# Altium project BLDC_ESC.PrjPcb
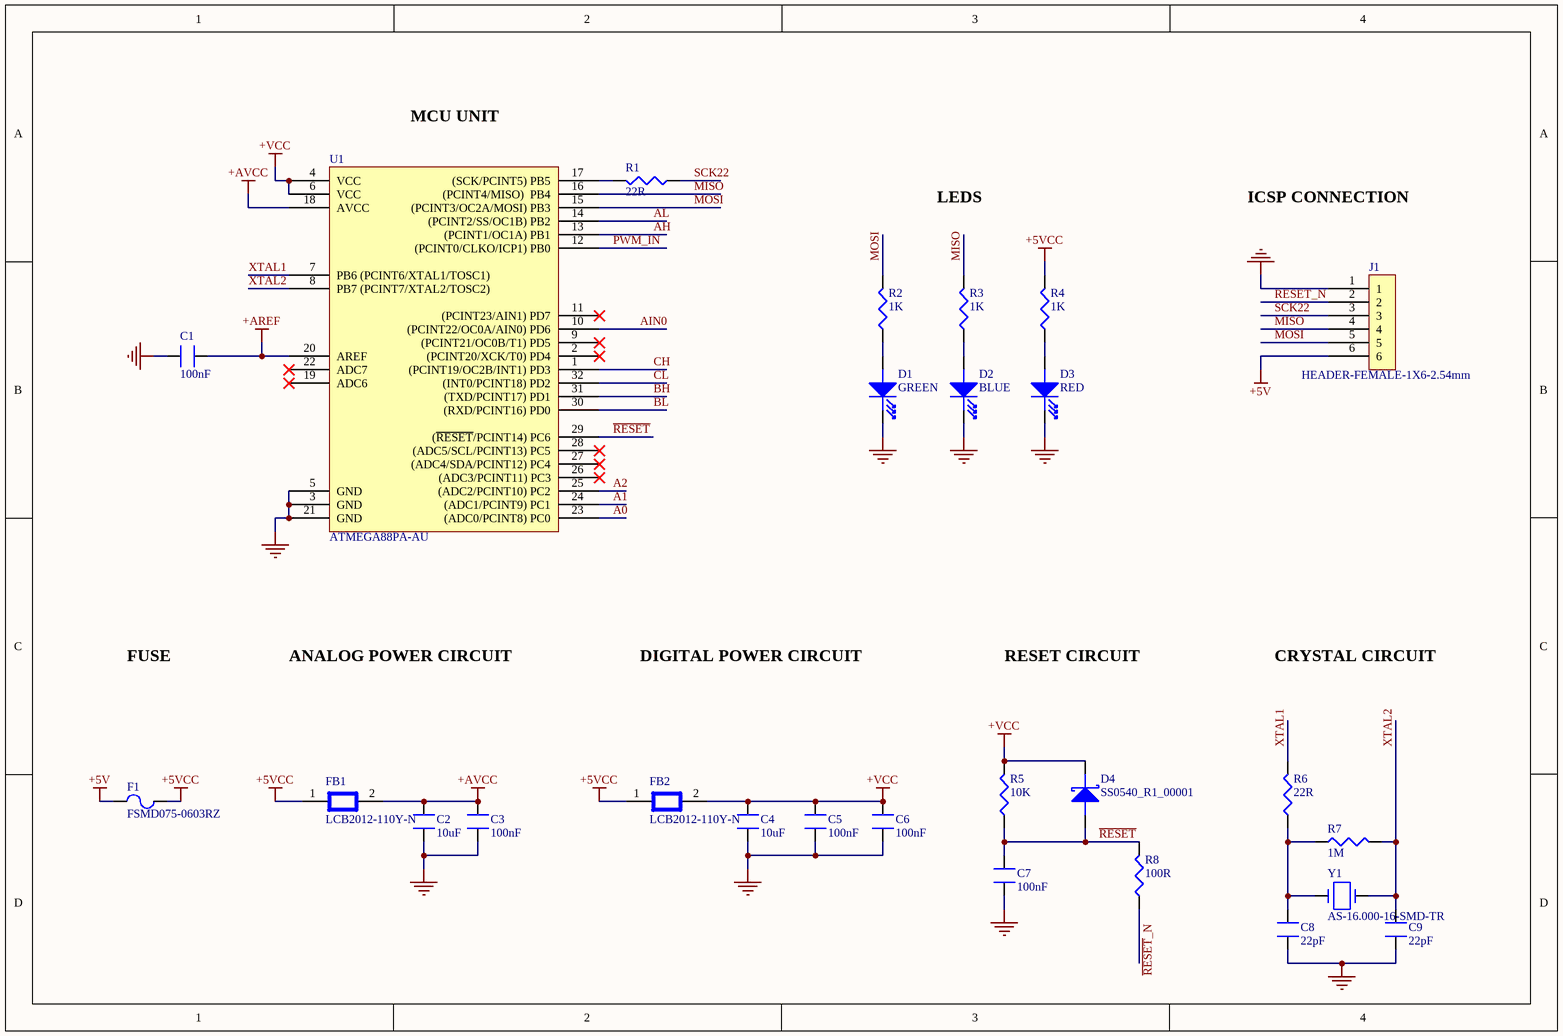
[diagram p0: ESC1.SchDoc]
Title: ESC
2 sheets, 69 parts. Net scope: global (net labels, ports and power ports of the same name join across sheets).
Board file: ESCV2.PcbDoc
Sheets:
  ESC1.SchDoc
  ESC2.SchDoc

## Sheet ESC1.SchDoc: ESC
size A4; DocumentNumber: 1; SheetNumber: 1; SheetTotal: 2

### Parts
C1  100nF  [Z0603]
C2  10uF  [Z0603]
C3  100nF  [Z0603]
C4  10uF  [Z0603]
C5  100nF  [Z0603]
C6  100nF  [Z0603]
C7  100nF  [Z0603]
C8  22pF  [Z0603]
C9  22pF  [Z0603]
D1  GREEN  [LED-0603]
D2  BLUE  [LED-0603]
D3  RED  [LED-0603]
D4  SS0540_R1_00001  [SOD-123]
F1  FSMD075-0603RZ  [F-0603]
FB1  LCB2012-110Y-N  [C0805]
FB2  LCB2012-110Y-N  [C0805]
J1  HEADER-FEMALE-1X6-2.54mm  [FEMALE-1X6-2.54mm]
R1  22R  [Z0603]
R2  1K  [Z0603]
R3  1K  [Z0603]
R4  1K  [Z0603]
R5  10K  [Z0603]
R6  22R  [Z0603]
R7  1M  [Z0603]
R8  100R  [Z0603]
U1  ATMEGA88PA-AU  [TQFP32(ATMEGA88)]
Y1  AS-16.000-16-SMD-TR  [AS-16.000-16-SMD-TR]

### Nets
+5V: F1.1 J1.6
+5VCC: F1.2 FB1.1 FB2.1 R4.2
+AREF: C1.1 U1.20(AREF)
+AVCC: C2.2 C3.2 FB1.2 U1.18(AVCC)
+VCC: C4.2 C5.2 C6.2 D4.1(Cathode) FB2.2 R5.2 U1.4(VCC) U1.6(VCC)
GND: C1.2 C2.1 C3.1 C4.1 C5.1 C6.1 C7.1 C8.2 C9.2 D1.1(Cathode) D2.1(Cathode) D3.1(Cathode) J1.1 U1.3(GND) U1.5(GND) U1.21(GND)
A0: U1.23((ADC0/PCINT8)_PC0)
A1: U1.24((ADC1/PCINT9)_PC1)
A2: U1.25((ADC2/PCINT10)_PC2)
AH: U1.13((PCINT1/OC1A)_PB1)
AIN0: U1.10((PCINT22/OC0A/AIN0)_PD6)
AL: U1.14((PCINT2/SS/OC1B)_PB2)
BH: U1.31((TXD/PCINT17)_PD1)
BL: U1.30((RXD/PCINT16)_PD0)
CH: U1.1((PCINT19/OC2B/INT1)_PD3)
CL: U1.32((INT0/PCINT18)_PD2)
MISO: J1.4 R3.2 U1.16((PCINT4/MISO)__PB4)
MOSI: J1.5 R2.2 U1.15((PCINT3/OC2A/MOSI)_PB3)
PWM_IN: U1.12((PCINT0/CLKO/ICP1)_PB0)
~{RESET}: C7.2 D4.2(Anode) R5.1 R8.2 U1.29((~{RESET}/PCINT14)_PC6)
~{RESET}_N: J1.2 R8.1
SCK22: J1.3 R1.1
XTAL1: R6.2 U1.7(PB6_(PCINT6/XTAL1/TOSC1))
XTAL2: C9.1 R7.2 U1.8(PB7_(PCINT7/XTAL2/TOSC2)) Y1.2
NetC8_1: C8.1 R6.1 R7.1 Y1.1
NetD1_2: D1.2(Anode) R2.1
NetD2_2: D2.2(Anode) R3.1
NetD3_2: D3.2(Anode) R4.1
NetR1_2: R1.2 U1.17((SCK/PCINT5)_PB5)

Not connected (* = marked no-connect by the designer): U1 2((PCINT20/XCK/T0)_PD4)* 9((PCINT21/OC0B/T1)_PD5)* 11((PCINT23/AIN1)_PD7)* 19(ADC6)* 22(ADC7)* 26((ADC3/PCINT11)_PC3)* 27((ADC4/SDA/PCINT12)_PC4)* 28((ADC5/SCL/PCINT13)_PC5)*

### Notes on the sheet
- MCU UNIT
- LEDS
- ICSP CONNECTION
- FUSE
- ANALOG POWER CIRCUIT
- DIGITAL POWER CIRCUIT
- RESET CIRCUIT
- CRYSTAL CIRCUIT

### Library data of the parts
C1 C3 C5-C7 = CL10B104KB8NNNC: Multi Layer Ceramic Capacitor (MLCC) / Cap Ceramic 0.1uF 50V X7R 10% Pad SMD 0603 125¡ãC T/R; Manufacturer: Samsung; OZDISAN_PRICE: 0.05 TRY; Supplier 1: RSComponents; Manufacturer Part Number: CL10B104KB8NNNC; RoHS: Yes; Category: Ceramic Capacitors; Stock 1: 17024000; Pricing 1: 4000=0,00800, 8000=0,00800, 16000=0,00800, 24000=0,00700, 40000=0,00600, 4000=0,00600, 8000=0,00600, 16000=0,00600, 24000=0,00500, 40000=0,00400 (USD); Mount: Surface Mount; Case/Package: 0603; Case Code (Metric): 1608; Case Code (Imperial): 0603; Material: Ceramic; Contact Plating: Tin; Min Operating Temperature: -55°C; Max Operating Temperature: 125°C; Capacitance: 100nF; Dielectric: X7R; Tolerance: 10%; Voltage Rating: 50V; Package Quantity: 1; Packaging: Tape and Reel; Voltage: 50V; Voltage Rating (DC): 50V; Series: CL; Construction: Flat; Length: 1.6mm; Width: 0.031inch; Height: 0.8mm; Depth: 0.8mm; Thickness: 0.035inch; Radiation Hardening: No; Lead Free: Lead Free; RoHS Compliant: Yes; Supplier Part Number 1: 7665443; ComponentLink4Description: OZDISAN_LINK; ComponentLink4URL: https://ozdisan.com/pasif-komponentler/kondansatorler/smt-smd-ve-mlcc-kondansatorler/CL10B104KB8NNNC
C2 C4 = CL10A106KP8NNNC: Cap Ceramic 10uF 10V X5R 10% Pad SMD 0603 85C T/R; Manufacturer: Samsung; OZDISAN_PRICE: 0.60 TRY; Supplier 1: Future Electronics; Manufacturer Part Number: CL10A106KP8NNNC; RoHS: Yes; Category: Ceramic Capacitors; Stock 1: 202000; Pricing 1: 4000=0,03170, 8000=0,02840, 12000=0,02830, 20000=0,02810, 40000=0,02790 (USD); Mount: Surface Mount; Case/Package: 0603; Case Code (Metric): 1608; Case Code (Imperial): 0603; Material: Ceramic; Contact Plating: Tin; Min Operating Temperature: -55°C; Max Operating Temperature: 85°C; Capacitance: 10uF; Tolerance: 10%; Dielectric: X5R; Package Quantity: 1; Packaging: Tape and Reel; Voltage Rating: 10V; Voltage Rating (DC): 10V; Series: CL; Construction: Flat; Length: 1.6mm; Width: 0.031inch; Height: 0.8mm; Thickness: 0.035inch; Depth: 0.8mm; Radiation Hardening: No; Lead Free: Lead Free; RoHS Compliant: Yes; Supplier Part Number 1: 5232459; ComponentLink4Description: OZDISAN_LINK; ComponentLink4URL: https://ozdisan.com/Product/Detail/350863/CL10A106KP8NNNC
C8 C9 = CL10C220JB8NNNC: Ceramic capacitor SMD-0603 22pF /50V NP0# J +-5%, Samsung, RoHS; Tolerance: 5%; Dielectric: C0G; Voltage: 50V; Temperature Coefficient: 300ppm/°C; OZDISAN_PRICE: 0.09 TRY; Supplier 1: RSComponents; Manufacturer: Samsung; Manufacturer Part Number: CL10C220JB8NNNC; RoHS: Yes; Category: Ceramic Capacitors; Stock 1: 1; Pricing 1: 4000=0,01100, 8000=0,01100, 16000=0,01000, 24000=0,00800, 40000=0,00700 (USD); Mount: Surface Mount; Case/Package: 0603; Case Code (Metric): 1608; Case Code (Imperial): 0603; Material: Ceramic; Contact Plating: Tin; Min Operating Temperature: -55°C; Max Operating Temperature: 125°C; Capacitance: 22pF; Voltage Rating (DC): 50V; Voltage Rating: 50V; Package Quantity: 1; Packaging: Tape and Reel; Series: CL; Length: 0.063inch; Width: 0.031inch; Height: 0.8mm; Depth: 0.8mm; Thickness: 0.035inch; Radiation Hardening: No; Lead Free: Lead Free; RoHS Compliant: Yes; Supplier Part Number 1: 7665033; ComponentLink5Description: OZDISAN_LINK; ComponentLink5URL: https://ozdisan.com/pasif-komponentler/kondansatorler/smt-smd-ve-mlcc-kondansatorler/CL10C220JB8NNNC
D1 = HL-PST-1608U51GC: OZDISAN_PRICE: 0.22 TRY; Case-Package: 0603; ComponentLink1Description: OZDISAN_LINK; ComponentLink1URL: https://ozdisan.com/Product/Detail/471660/HL-PST-1608U51GC
D2 = 27-21/B7C-ZR1S1N/3C: OZDISAN_PRICE: 1,46 TRY; ComponentLink1Description: OZDISAN_LINK; ComponentLink1URL: https://ozdisan.com/led-ve-aydinlatma-cozumleri/led-komponentler/sinyal-ledler-renkli/27-21B7C-ZR1S1N3C; Case-Package: 0603
D3 = LTST-C190KRKT: 0603 red led alingap 631nm-639nm water clear 18-180mcd 130d; Manufacturer: Vishay Lite-On; Lens Color: Colorless; Luminous Intensity: 54mcd; Forward Current: 30mA; Viewing Angle: 130°; Forward Voltage: 2.4V; Lens Style: Diffused,Colorless,Clear,Rectangular; Power Rating: 75mW; Dominant Wavelength: 631nm; Test Current: 20mA; Number of Elements: 1; Wavelength: 639nm; Reverse Voltage: 5V; OZDISAN_PRICE: 0.38 TRY; Supplier 1: Digi-Key; Manufacturer Part Number: LTST-C190KRKT; RoHS: Yes; Category: LEDs; Stock 1: 874288; Pricing 1: 1=0,24000, 10=0,13200, 100=0,06110, 500=0,05640, 1000=0,04418, 2000=0,04324 (USD); Mount: Surface Mount; Case/Package: 0603; Number of Pins: 2; Color: Red; Case Code (Metric): 1608; Case Code (Imperial): 0603; Min Operating Temperature: -55°C; Max Operating Temperature: 85°C; Packaging: Tape and Reel; Package Quantity: 1; Illumination Color: Red; Lens Transparency: Clear; Power Dissipation: 75mW; Number of LEDs: 1; Length: 1.6mm; Width: 0.8mm; Height: 0.8mm; Depth: 0.8mm; Radiation Hardening: No; Lead Free: Lead Free; RoHS Compliant: Yes; Supplier Part Number 1: 160-1436-1-ND; ComponentLink10Description: OZDISAN_LINK; ComponentLink10URL: https://ozdisan.com/led-ve-aydinlatma-cozumleri/led-komponentler/sinyal-ledler-renkli/LTST-C190KRKT
D4 = SS0540_R1_00001: Diode Schottky 40V 0.5A 2-Pin SOD-123 T/R; Manufacturer: Pan Jit; Peak Non-Repetitive Surge Current: 5.5A; Element Configuration: Single; OZDISAN_PRICE: 0.55 TRY; Supplier 1: Digi-Key; Manufacturer Part Number: SS0540_R1_00001; RoHS: Yes; Category: Rectifier Diodes; Stock 1: 6025; Pricing 1: 1=0,29000, 10=0,23400, 100=0,12410, 500=0,08168, 1000=0,05554 (USD); Mount: Surface Mount; Min Operating Temperature: -55°C; Max Operating Temperature: 125°C; Max Repetitive Reverse Voltage (Vrrm): 40V; Radiation Hardening: No; RoHS Compliant: Yes; Supplier Part Number 1: 3757-SS0540_R1_00001CT-ND; ComponentLink3Description: OZDISAN_LINK; ComponentLink3URL: https://ozdisan.com/guc-yari-iletkenleri/diyotlar-modul-diyotlar-ve-dogrultucular/schottky-diyotlar/SS0540R100001
F1 = FSMD075-0603RZ: OZDISAN_PRICE: 3.16 TRY; Current Rating: 0.75; Max Voltage: 6V; Case-Package: 0603; ComponentLink1Description: OZDISAN_LINK; ComponentLink1URL: https://ozdisan.com/guc-yari-iletkenleri/devre-koruyucu-komponentler/ptc-sigortalar/FSMD075-0603RZ
FB1 FB2 = LCB2012-110Y-N: OZDISAN_PRICE: 0,22 TRY; ComponentLink1Description: OZDISAN_LINK; ComponentLink1URL: https://ozdisan.com/pasif-komponentler/induktorler/bead-feritler/LCB2012-110Y-N; Case-Package: 0603
J1 = PPPC061LFBN-RC: CONN HDR 6POS 0.1 GOLD PCB; Manufacturer: Sullins; Connector Type: Header,Socket; Number of Positions: 6; Pitch: 0.1inch; Supplier 1: Digi-Key; Manufacturer Part Number: PPPC061LFBN-RC; RoHS: Yes; Category: Connectors; Stock 1: 33601; Pricing 1: 1=0,53000, 10=0,46500, 80=0,38300, 440=0,33300, 1000=0,27472, 5000=0,24142, 10000=0,24050 (USD); Mount: Through Hole; Color: Black; Contact Plating: Gold; Housing Material: Plastic; Contact Material: Bronze; Package Quantity: 1000; Number of Rows: 1; Packaging: Bulk; Termination: Solder; Length: 15.7mm; Width: 2.5mm; Height: 8.5mm; Lead Free: Lead Free; ComponentLink1URL: https://media.digikey.com/pdf/Data%20Sheets/Sullins%20PDFs/Female_Headers.100_DS.pdf?src-supplier=Digi-Key; ComponentLink1Description: https://media.digikey.com/pdf/Data%20Sheets/Sullins%20PDFs/Female_Headers.100_DS.pdf?src-supplier=Digi-Key; Supplier Part Number 1: S7039-ND
R1 R6 = MC0603SAF220JT5E: MULTICOMP         MC0603SAF220JT5E            RESISTOR, THICK FILM, 22OHM, 100mW, 1%; Voltage Rating: 75V; Temperature Coefficient: 100ppm/°C; OZDISAN_PRICE: 0.02 TRY; Supplier 1: Newark; Manufacturer: Multicomp; Manufacturer Part Number: MC0603SAF220JT5E; RoHS: Yes; Category: Resistors; Case/Package: 0603; Number of Pins: 2; Case Code (Metric): 1608; Case Code (Imperial): 0603; Packaging: Cut Tape; Resistance: 22R; Resistor Type: Thick Film; Power Rating: 100mW; Tolerance: 1%; Voltage Rating (DC): 75V; Resistance Tolerance: 1%; RoHS Compliant: Yes; REACH SVHC: Unknown; Supplier Part Number 1: 79M5934; ComponentLink2Description: OZDISAN_LINK; ComponentLink2URL: https://ozdisan.com/pasif-komponentler/direncler/smt-smd-ve-cip-direncler/0603SAF220JT5E
R2-R4 = MC0603SAF1001T5E: MULTICOMP - MC0603SAF1001T5E - THICK FILM RESISTOR, 1KOHM, 100mW, 1%; Resistance: 1kR; Voltage Rating: 75V; Temperature Coefficient: 100ppm/°C; OZDISAN_PRICE: 0.02 TRY; Supplier 1: Farnell; Manufacturer: Multicomp; Manufacturer Part Number: MC0603SAF1001T5E; RoHS: Yes; Category: Resistors; Stock 1: 340; Pricing 1: 1=0,00890, 10=0,00810, 100=0,00730, 1000=0,00390 (GBP); Case/Package: 0603; Case Code (Metric): 1608; Case Code (Imperial): 0603; Tolerance: 1%; Power Rating: 100mW; Resistor Type: Thick Film; Packaging: Cut Tape; Voltage Rating (DC): 75V; Resistance Tolerance: 1%; RoHS Compliant: Yes; REACH SVHC: Unknown; Supplier Part Number 1: 1632391; ComponentLink2Description: OZDISAN_LINK; ComponentLink2URL: https://ozdisan.com/pasif-komponentler/direncler/smt-smd-ve-cip-direncler/0603SAF1001T5E
R5 = CQ03SAF1002T5E: OZDISAN_PRICE: 0.03 TRY; ComponentLink1Description: OZDISAN_LINK; ComponentLink1URL: https://ozdisan.com/pasif-komponentler/direncler/smt-smd-ve-cip-direncler/CQ03SAF1002T5E; Case-Package: 0603
R7 = MC0603SAF1004T5E: Res General Purpose Thick Film 0603 1M Ohm 1% 1/10W ±100ppm/°C Molded T/R; Manufacturer: Multicomp; Resistance: 1MR; Power Rating: 100mW; Voltage Rating: 75V; OZDISAN_PRICE: 0.02 TRY; Supplier 1: Farnell; Manufacturer Part Number: MC0603SAF1004T5E; RoHS: Yes; Category: Uncategorized; Stock 1: 15998; Pricing 1: 1=0,00910, 10=0,00830, 100=0,00740, 1000=0,00400 (GBP); Case/Package: 0603; Case Code (Metric): 1608; Case Code (Imperial): 0603; Tolerance: 1%; Resistor Type: Thick Film; Packaging: Cut Tape; Temperature Coefficient: 100ppm/°C; Voltage Rating (DC): 75V; Resistance Tolerance: 1%; REACH SVHC: Unknown; RoHS Compliant: Yes; ComponentLink1URL: https://datasheet.ciiva.com/7919/ta-677-7919113.pdf?src-supplier=Element14; ComponentLink1Description: https://datasheet.ciiva.com/7919/ta-677-7919113.pdf?src-supplier=Element14; Supplier Part Number 1: 1631320; ComponentLink2Description: ÖZDISAN_LINK; ComponentLink2URL: https://ozdisan.com/pasif-komponentler/direncler/smt-smd-ve-cip-direncler/0603SAF1004T5E
R8 = 0603SAJ0101T5E: OZDISAN_PRICE: 0.02 TRY; ComponentLink1Description: OZDISAN_LINK; ComponentLink1URL: https://ozdisan.com/pasif-komponentler/direncler/smt-smd-ve-cip-direncler/0603SAJ0101T5E; Case-Package: 0603
U1 = ATMEGA88PA-AU: MCU 8-bit ATmega AVR RISC 8KB Flash 2.5V/3.3V/5V 32-Pin TQFP; Manufacturer: Microchip / Atmel; Interface: SPI,UART,I2C,USART,2-Wire; Frequency: 20MHz; Number of I/Os: 23; Oscillator Type: Internal; Peripherals: Brown-out Detect/Reset,POR,PWM,WDT; RAM Size: 1KB; Max Supply Voltage: 5.5V; Min Supply Voltage: 1.8V; Number of Timers/Counters: 3; Data Bus Width: 8b; Watchdog Timer: Yes; Number of PWM Channels: 6; Number of ADC Channels: 8; Number of SPI Channels: 1; Voltage: 5V; OZDISAN_PRICE: 33,63 TRY; Supplier 1: Arrow Electronics; Manufacturer Part Number: ATMEGA88PA-AU; RoHS: Yes; Category: Microcontrollers; Mount: Surface Mount; Case/Package: A; Number of Pins: 32; Contact Plating: Tin,Matte; Min Operating Temperature: -40°C; Max Operating Temperature: 85°C; Packaging: Tray; Core Architecture: AVR; Package Quantity: 250; Memory Type: FLASH; Memory Size: 8KB; Number of Programmable I/O: 23; Max Frequency: 20MHz; Density: 8KB; Number of I2C Channels: 1; Termination: SMD/SMT; Series: AVR® ATmega; Length: 7mm; Width: 7mm; Height: 1.05mm; Radiation Hardening: No; REACH SVHC: No SVHC; Lead Free: Lead Free; Supplier Part Number 1: ATMEGA88PA-AU; ComponentLink4Description: OZDISAN_LINK; ComponentLink4URL: https://ozdisan.com/entegre-devreler-ics/embedded-entegreler/mikroislemciler/ATMEGA88PA-AU
Y1 = AS-16.000-16-SMD-TR: AS-SMD Series 16 MHz ±30 ppm 16pF -20°C TO +70°C SMT Microprocessor Crystal; Manufacturer: Raltron Electronics; Frequency Tolerance: 30ppm; Frequency: 16MHz; Capacitance: 1.6E-11F; OZDISAN_PRICE: 1.95 TRY; Supplier 1: Future Electronics; Manufacturer Part Number: AS-16.000-16-SMD-TR; RoHS: Yes; Pricing 1: 1000=0,12700 (USD); Min Operating Temperature: -20°C; Max Operating Temperature: 70°C; Load Capacitance: 16pF; Lead Free: Lead Free; Supplier Part Number 1: 5574900; ComponentLink2Description: OZDISAN_LINK; ComponentLink2URL: https://ozdisan.com/Product/Detail/40446/AS-16-000-16-SMD-TR

## Sheet ESC2.SchDoc: ESC
size A4; DrawnBy: BRAIN.DLL; DocumentNumber: 2; Revision: REV 1.0; SheetNumber: 2; SheetTotal: 2
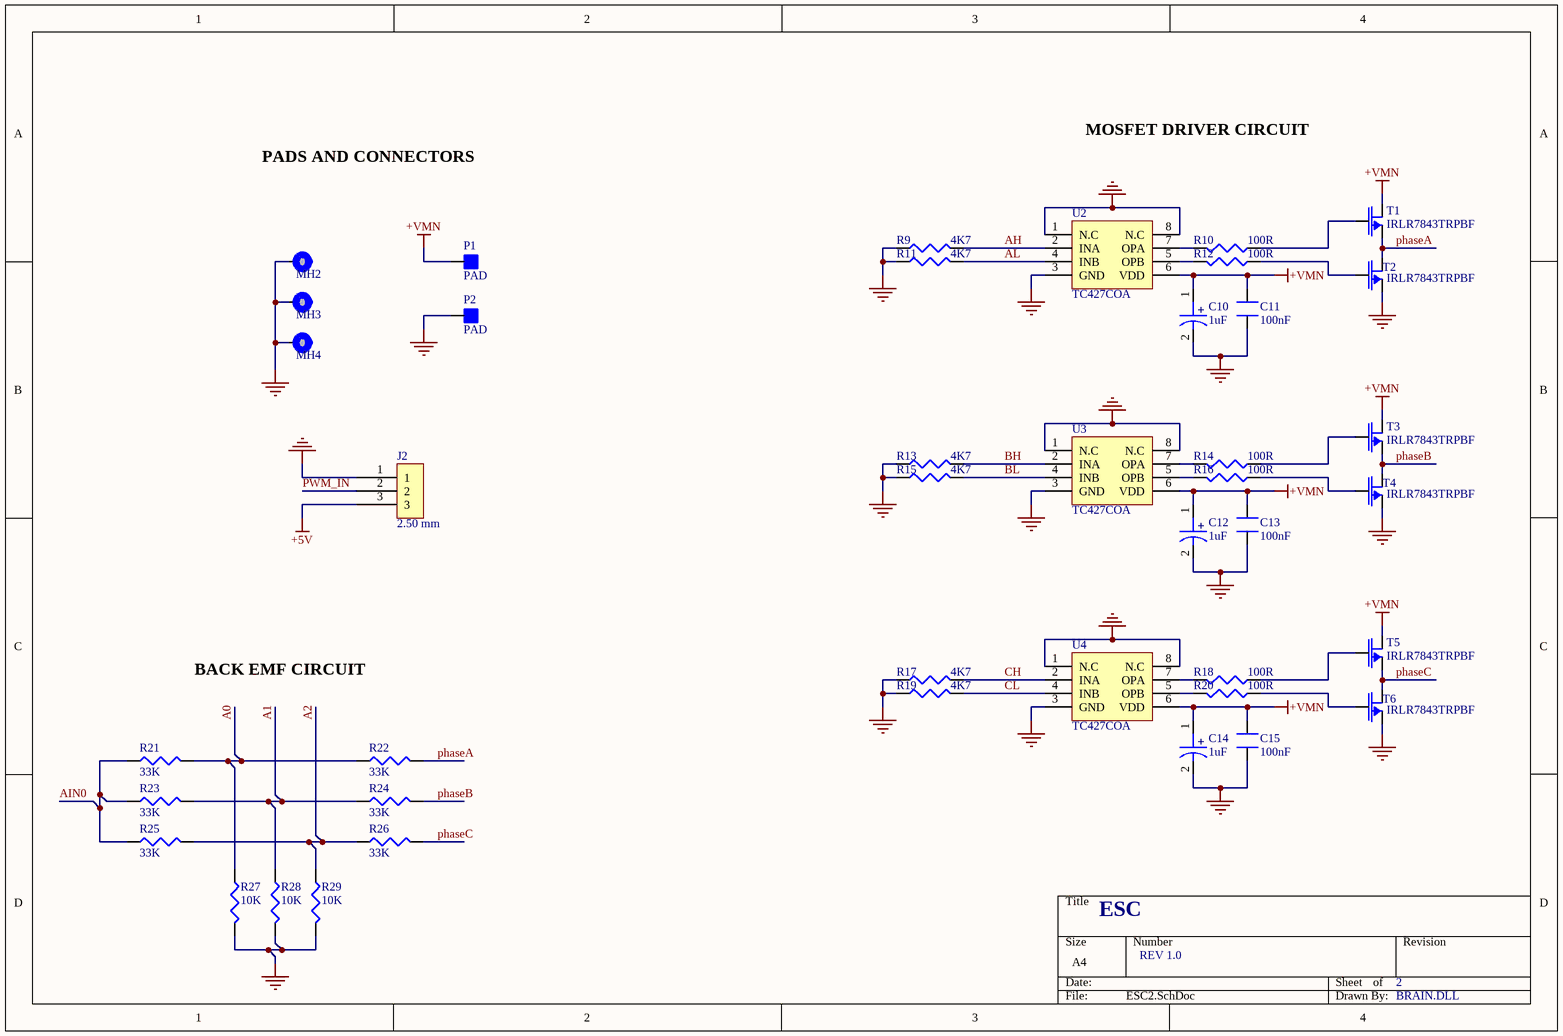
[diagram p1: ESC2.SchDoc]

### Parts
C10  1uF  [1206 TANTAL CAP]
C11  100nF  [Z0603]
C12  1uF  [1206 TANTAL CAP]
C13  100nF  [Z0603]
C14  1uF  [1206 TANTAL CAP]
C15  100nF  [Z0603]
J2  2.50 mm  [L-KLS1-XL4-2.50-03-R]
MH2  MH_7.4MMC_3.2MMD  [MH_7.4MMC_3.2MMD_NON_COPPER_NPLT]  (value not drawn)  (no BOM)
MH3  MH_7.4MMC_3.2MMD  [MH_7.4MMC_3.2MMD_NON_COPPER_NPLT]  (value not drawn)  (no BOM)
MH4  MH_7.4MMC_3.2MMD  [MH_7.4MMC_3.2MMD_NON_COPPER_NPLT]  (value not drawn)  (no BOM)
P1  PAD  [SQARE_PAD]  (no BOM)
P2  PAD  [SQARE_PAD]  (no BOM)
R9  4K7  [Z0603]
R10  100R  [Z0603]
R11  4K7  [Z0603]
R12  100R  [Z0603]
R13  4K7  [Z0603]
R14  100R  [Z0603]
R15  4K7  [Z0603]
R16  100R  [Z0603]
R17  4K7  [Z0603]
R18  100R  [Z0603]
R19  4K7  [Z0603]
R20  100R  [Z0603]
R21  33K  [Z0603]
R22  33K  [Z0603]
R23  33K  [Z0603]
R24  33K  [Z0603]
R25  33K  [Z0603]
R26  33K  [Z0603]
R27  10K  [Z0603]
R28  10K  [Z0603]
R29  10K  [Z0603]
T1  IRLR7843TRPBF  [TO-252-3]
T2  IRLR7843TRPBF  [TO-252-3]
T3  IRLR7843TRPBF  [TO-252-3]
T4  IRLR7843TRPBF  [TO-252-3]
T5  IRLR7843TRPBF  [TO-252-3]
T6  IRLR7843TRPBF  [TO-252-3]
U2  TC427COA  [SOIC-8]
U3  TC427COA  [SOIC-8]
U4  TC427COA  [SOIC-8]

### Nets
+5V: J2.3
+VMN: C10.1 C11.1 C12.1 C13.1 C14.1 C15.1 P1.1 T1.2(DRAIN) T3.2(DRAIN) T5.2(DRAIN) U2.6(VDD) U3.6(VDD) U4.6(VDD)
GND: C10.2 C11.2 C12.2 C13.2 C14.2 C15.2 J2.1 MH2.1 MH3.1 MH4.1 P2.1 R9.1 R11.1 R13.1 R15.1 R17.1 R19.1 R27.2 R28.2 R29.2 T2.3(SOURCE) T4.3(SOURCE) T6.3(SOURCE) U2.1(N.C) U2.3(GND) U2.8(N.C) U3.1(N.C) U3.3(GND) U3.8(N.C) U4.1(N.C) U4.3(GND) U4.8(N.C)
A0: R21.2 R22.1 R27.1
A1: R23.2 R24.1 R28.1
A2: R25.2 R26.1 R29.1
AH: R9.2 U2.2(INA)
AIN0: R21.1 R23.1 R25.1
AL: R11.2 U2.4(INB)
BH: R13.2 U3.2(INA)
BL: R15.2 U3.4(INB)
CH: R17.2 U4.2(INA)
CL: R19.2 U4.4(INB)
phaseA: R22.2 T1.3(SOURCE) T2.2(DRAIN)
phaseB: R24.2 T3.3(SOURCE) T4.2(DRAIN)
phaseC: R26.2 T5.3(SOURCE) T6.2(DRAIN)
PWM_IN: J2.2
NetR10_1: R10.1 T1.1(GATE)
NetR10_2: R10.2 U2.7(OPA)
NetR12_1: R12.1 T2.1(GATE)
NetR12_2: R12.2 U2.5(OPB)
NetR14_1: R14.1 T3.1(GATE)
NetR14_2: R14.2 U3.7(OPA)
NetR16_1: R16.1 T4.1(GATE)
NetR16_2: R16.2 U3.5(OPB)
NetR18_1: R18.1 T5.1(GATE)
NetR18_2: R18.2 U4.7(OPA)
NetR20_1: R20.1 T6.1(GATE)
NetR20_2: R20.2 U4.5(OPB)

### Notes on the sheet
- PADS AND CONNECTORS
- MOSFET DRIVER CIRCUIT
- BACK EMF CIRCUIT
- (in symbol T491A105K035AT) +

### Library data of the parts
C10 C12 C14 = T491A105K035AT: Cap Tant Solid 1uF 35V A CASE 10% (3.2 X 1.6 X 1.6mm) SMD 3216-18 7.5 Ohm 125 C T/R; Manufacturer: KEMET; Dielectric Material: Tantalum; Tolerance: 20%; ESR (Equivalent Series Resistance): 7.5R; Life (Hours): 2000Hour; Dissipation Factor: 4%; Polarity: Polar; Ripple Current: 100mA; Leakage Current: 500nA; Voltage: 25V; OZDISAN_PRICE: 1.78 TRY; Supplier 1: Digi-Key; Manufacturer Part Number: T491A105K035AT; RoHS: Yes; Category: Tantalum Capacitors; Stock 1: 48; Pricing 1: 1=0,53000, 10=0,37100, 50=0,26000, 100=0,22290, 500=0,16716, 1000=0,14115 (USD); Mount: Surface Mount,PCB; Case/Package: 1206; Number of Pins: 2; Case Code (Metric): 3216; Case Code (Imperial): 1206; Min Operating Temperature: -55°C; Max Operating Temperature: 125°C; Capacitance: 1uF; Packaging: Tape and Reel; Voltage Rating: 35V; Features: General Purpose; Package Quantity: 1; Voltage Rating (DC): 35V; Failure Rate: 0.001%; Termination: SMD/SMT; Length: 3.2mm; Width: 1.6mm; Height: 1.6mm; Depth: 1.6mm; Height - Seated (Max): 0.071inch; Radiation Hardening: No; RoHS Compliant: Yes; Lead Free: Lead Free; REACH SVHC: No SVHC; ComponentLink1URL: https://datasheet.ciiva.com/5933/1446014-5933344.pdf?src-supplier=Farnell; ComponentLink1Description: https://datasheet.ciiva.com/5933/1446014-5933344.pdf?src-supplier=Farnell; ComponentLink2URL: https://datasheet.ciiva.com/34303/2014692-34303850.pdf?src-supplier=Jameco; ComponentLink2Description: https://datasheet.ciiva.com/34303/2014692-34303850.pdf?src-supplier=Jameco; ComponentLink3URL: https://datasheet.ciiva.com/20171/458239-da-en-01-20171932.pdf?src-supplier=Rapid+Electronics; ComponentLink3Description: https://datasheet.ciiva.com/20171/458239-da-en-01-20171932.pdf?src-supplier=Rapid+Electronics; ComponentLink4URL: https://datasheet.ciiva.com/11793/0900766b80718482-11793428.pdf?src-supplier=RSComponents; ComponentLink4Description: https://datasheet.ciiva.com/11793/0900766b80718482-11793428.pdf?src-supplier=RSComponents; ComponentLink5URL: https://datasheet.ciiva.com/7759/kem-t2005-t491-7759103.pdf?src-supplier=Element14; ComponentLink5Description: https://datasheet.ciiva.com/7759/kem-t2005-t491-7759103.pdf?src-supplier=Element14; ComponentLink6URL: https://datasheet.ciiva.com/32431/t491a105k035zt-eng-tds-32431494.pdf?src-supplier=Distrelec; ComponentLink6Description: https://datasheet.ciiva.com/32431/t491a105k035zt-eng-tds-32431494.pdf?src-supplier=Distrelec; ComponentLink7URL: https://datasheet.ciiva.com/6248/kem-t2005-t491-6248103.pdf?src-supplier=Digi-Key; ComponentLink7Description: https://datasheet.ciiva.com/6248/kem-t2005-t491-6248103.pdf?src-supplier=Digi-Key; ComponentLink8URL: https://datasheet.ciiva.com/6248/kem-t2005-t491-6248102.pdf?src-supplier=Digi-Key; ComponentLink8Description: https://datasheet.ciiva.com/6248/kem-t2005-t491-6248102.pdf?src-supplier=Digi-Key; ComponentLink9URL: https://datasheet.ciiva.com/6248/kem-t2005-t491-6248104.pdf?src-supplier=Digi-Key; ComponentLink9Description: https://datasheet.ciiva.com/6248/kem-t2005-t491-6248104.pdf?src-supplier=Digi-Key; ComponentLink10URL: https://datasheet.ciiva.com/14595/70095774-14595590.pdf?src-supplier=Allied+Electronics; ComponentLink10Description: https://datasheet.ciiva.com/14595/70095774-14595590.pdf?src-supplier=Allied+Electronics; ComponentLink11URL: https://datasheet.ciiva.com/12883/kem-t2005-t491-12883366.pdf?src-supplier=Mouser; ComponentLink11Description: https://datasheet.ciiva.com/12883/kem-t2005-t491-12883366.pdf?src-supplier=Mouser; ComponentLink12Description: OZDISAN_LINK; ComponentLink12URL: https://ozdisan.com/pasif-komponentler/kondansatorler/tantal-kondansatorler/T491A105K035AT; Supplier Part Number 1: 399-8265-1-ND
C11 C13 C15 = CL10B104KB8NNNC: as C1 on sheet ESC1; Supplier 1: RSComponents; Manufacturer Part Number: CL10B104KB8NNNC; RoHS: Yes; Category: Ceramic Capacitors; Stock 1: 17024000; Pricing 1: 4000=0,00800, 8000=0,00800, 16000=0,00800, 24000=0,00700, 40000=0,00600, 4000=0,00600, 8000=0,00600, 16000=0,00600, 24000=0,00500, 40000=0,00400 (USD); Mount: Surface Mount; Case/Package: 0603; Case Code (Metric): 1608; Case Code (Imperial): 0603; Material: Ceramic; Contact Plating: Tin; Min Operating Temperature: -55°C; Max Operating Temperature: 125°C; Capacitance: 100nF; Dielectric: X7R; Tolerance: 10%; Voltage Rating: 50V; Package Quantity: 1; Packaging: Tape and Reel; Voltage: 50V; Voltage Rating (DC): 50V; Series: CL; Construction: Flat; Length: 1.6mm; Width: 0.031inch; Height: 0.8mm; Depth: 0.8mm; Thickness: 0.035inch; Radiation Hardening: No; Lead Free: Lead Free; RoHS Compliant: Yes; ComponentLink1URL: https://datasheet.ciiva.com/25803/cl10b104kb8nnnc-25803393.pdf?src-supplier=Digi-Key; ComponentLink1Description: https://datasheet.ciiva.com/25803/cl10b104kb8nnnc-25803393.pdf?src-supplier=Digi-Key; ComponentLink2URL: https://datasheet.ciiva.com/26838/getdatasheetpartid-89097-26838411.pdf?src-supplier=Verical; ComponentLink2Description: https://datasheet.ciiva.com/26838/getdatasheetpartid-89097-26838411.pdf?src-supplier=Verical; ComponentLink3URL: https://datasheet.ciiva.com/29198/456651-da-01-en-vs-kondensator-0605-29198839.pdf?src-supplier=Conrad; ComponentLink3Description: https://datasheet.ciiva.com/29198/456651-da-01-en-vs-kondensator-0605-29198839.pdf?src-supplier=Conrad; Supplier Part Number 1: 7665443; ComponentLink4Description: OZDISAN_LINK; ComponentLink4URL: https://ozdisan.com/pasif-komponentler/kondansatorler/smt-smd-ve-mlcc-kondansatorler/CL10B104KB8NNNC
J2 = L-KLS1-XL4-2.50-03-R: OZDISAN_PRICE: 0,27 TRY; ComponentLink1Description: OZDISAN_LINK; ComponentLink1URL: https://ozdisan.com/konnektor-ve-baglanti-elemanlari/konnektor-cesitleri/pcb-konnektorler/L-KLS1-XL4-2-50-03-R
MH2-MH4 = MH_7.4MMNC_3.2MMD: Mounting Hole 7.4 mm Diameter (Non Copper), 3.2 mm Drill NPTH
P1 P2 = SQARE_PAD
R9 R11 R13 R15 R17 R19 = MC0603SAF4701T5E: RES, THICK FILM, 4K7, 1%, 0.1W, 0603; Resistance: 4.7kohm; Resistance Tolerance: ± 1%; Power Rating: 100mW; Resistor...; Manufacturer: Multicomp; Voltage Rating: 75V; Resistance: 4.7kR; Temperature Coefficient: 100ppm/°C; OZDISAN_PRICE: 0.02 TRY; Supplier 1: Farnell; Manufacturer Part Number: MC0603SAF4701T5E; RoHS: Yes; Category: Uncategorized; Pricing 1: 1=0,00890, 10=0,00810, 100=0,00730, 1000=0,00400 (GBP); Case/Package: 0603; Number of Pins: 2; Case Code (Metric): 1608; Case Code (Imperial): 0603; Tolerance: 1%; Resistor Type: Thick Film; Packaging: Cut Tape; Voltage Rating (DC): 75V; Resistance Tolerance: 1%; RoHS Compliant: Yes; REACH SVHC: Unknown; ComponentLink1URL: https://datasheet.ciiva.com/7919/ta-677-7919115.pdf?src-supplier=Element14; ComponentLink1Description: https://datasheet.ciiva.com/7919/ta-677-7919115.pdf?src-supplier=Element14; Supplier Part Number 1: 1632439; ComponentLink2Description: OZDISAN_LINK; ComponentLink2URL: https://ozdisan.com/pasif-komponentler/direncler/smt-smd-ve-cip-direncler/0603SAF4701T5E
R10 R12 R14 R16 R18 R20 = 0603SAJ0101T5E: OZDISAN_PRICE: 0.02 TRY; ComponentLink1Description: OZDISAN_LINK; ComponentLink1URL: https://ozdisan.com/pasif-komponentler/direncler/smt-smd-ve-cip-direncler/0603SAJ0101T5E; Case-Package: 0603
R21-R26 = RI0603L3302FT: OZDISAN_PRICE: 0.09 TRY; ComponentLink1Description: OZDISAN_LINK; ComponentLink1URL: https://ozdisan.com/pasif-komponentler/direncler/smt-smd-ve-cip-direncler/TC0325B3302T5C; Case-Package: 0603
R27-R29 = CQ03SAF1002T5E: OZDISAN_PRICE: 0.03 TRY; ComponentLink1Description: OZDISAN_LINK; ComponentLink1URL: https://ozdisan.com/pasif-komponentler/direncler/smt-smd-ve-cip-direncler/CQ03SAF1002T5E; Case-Package: 0603
T1-T6 = IRLR7843TRPBF: MOSFET, 30V, 161A, 3.3 mOhm, 34 nC Qg, Logic Level, D-Pak; Manufacturer: International Rectifier; Rise Time: 42ns; Fall Time: 19ns; Turn-Off Delay Time: 34ns; Turn-On Delay Time: 25ns; Gate to Source Voltage (Vgs): 20V; Rds On Max: 3.3mR; Input Capacitance: 4.38nF; Max Power Dissipation: 140W; Element Configuration: Single; Nominal Vgs: 2.3V; Number of Elements: 1; Supplier 1: Allied Electronics; Manufacturer Part Number: IRLR7843TRPBF; RoHS: Yes; Category: MOSFETs; Mount: Surface Mount; Case/Package: DPAK; Number of Pins: 3; Min Operating Temperature: -55°C; Max Operating Temperature: 175°C; Continuous Drain Current (ID): 161A; Package Quantity: 1; Packaging: Cut Tape; Drain to Source Voltage (Vdss): 30V; Drain to Source Breakdown Voltage: 30V; Drain to Source Resistance: 3.3mR; Power Dissipation: 140W; Voltage Rating (DC): 30V; Current Rating: 161A; On-State Resistance: 3.3MR; Series: HEXFET®; Drain-source On Resistance-Max: 3.3MR; Length: 6.73mm; Width: 6.22mm; Height: 2.39mm; Radiation Hardening: No; RoHS Compliant: Yes; REACH SVHC: No SVHC; Lead Free: Lead Free; Supplier Part Number 1: 70017418
U2-U4 = TC427COA: IC MOSFET DVR 1.5A DUAL HS 8SOIC; Manufacturer: Microchip; Number of Outputs: 2; Max Supply Voltage: 18V; Min Supply Voltage: 4.5V; Rise Time: 30ns; Propagation Delay: 75ns; Operating Supply Voltage: 16V; Max Power Dissipation: 470mW; Nominal Supply Current: 8mA; Output Impedance: 6R; OZDISAN_PRICE: 20,56 TRY; Supplier 1: Digi-Key; Manufacturer Part Number: TC427COA; RoHS: Yes; Category: Gate Drivers; Stock 1: 562; Pricing 1: 1=1,45000, 25=1,19800, 100=1,08120 (USD); Mount: Surface Mount; Case/Package: SOIC; Number of Pins: 8; Min Operating Temperature: 0°C; Max Operating Temperature: 70°C; Package Quantity: 100; Packaging: Rail/Tube; Max Output Current: 1.5A; Number of Drivers: 2; Fall Time: 30ns; Power Dissipation: 470mW; Max Supply Current: 8mA; Turn-On Delay Time: 75ns; Supply Current: 8mA; Series: -; Length: 4.9mm; Width: 3.91mm; Height: 1.42mm; Radiation Hardening: No; Lead Free: Lead Free; RoHS Compliant: Yes; REACH SVHC: No SVHC; ComponentLink1URL: https://datasheet.ciiva.com/8064/21415c-8064216.pdf?src-supplier=Element14; ComponentLink1Description: https://datasheet.ciiva.com/8064/21415c-8064216.pdf?src-supplier=Element14; ComponentLink2URL: https://datasheet.ciiva.com/1949/filehandler-aspxddocname-en011463-1949817.pdf?src-supplier=Digi-Key; ComponentLink2Description: https://datasheet.ciiva.com/1949/filehandler-aspxddocname-en011463-1949817.pdf?src-supplier=Digi-Key; ComponentLink3URL: https://datasheet.ciiva.com/3226/cn011463-3226573.pdf?src-supplier=Avnet; ComponentLink3Description: https://datasheet.ciiva.com/3226/cn011463-3226573.pdf?src-supplier=Avnet; ComponentLink4URL: https://datasheet.ciiva.com/17237/cn011463-17237167.pdf?src-supplier=Avnet+Europe; ComponentLink4Description: https://datasheet.ciiva.com/17237/cn011463-17237167.pdf?src-supplier=Avnet+Europe; Supplier Part Number 1: TC427COA-ND; ComponentLink5Description: OZDISAN_LINK; ComponentLink5URL: https://ozdisan.com/entegre-devreler-ics/guc-entegreleri/guc-surucu-entegreleri/TC427COA

## Nets that join several sheets
+5V: ESC1 (F1.1 J1.6), ESC2 (J2.3)
GND: ESC1 (16 pins), ESC2 (32 pins)
A0: ESC1 (U1.23), ESC2 (R21.2 R22.1 R27.1)
A1: ESC1 (U1.24), ESC2 (R23.2 R24.1 R28.1)
A2: ESC1 (U1.25), ESC2 (R25.2 R26.1 R29.1)
AH: ESC1 (U1.13), ESC2 (R9.2 U2.2)
AIN0: ESC1 (U1.10), ESC2 (R21.1 R23.1 R25.1)
AL: ESC1 (U1.14), ESC2 (R11.2 U2.4)
BH: ESC1 (U1.31), ESC2 (R13.2 U3.2)
BL: ESC1 (U1.30), ESC2 (R15.2 U3.4)
CH: ESC1 (U1.1), ESC2 (R17.2 U4.2)
CL: ESC1 (U1.32), ESC2 (R19.2 U4.4)
PWM_IN: ESC1 (U1.12), ESC2 (J2.2)